# Altium schematic sheet Sensors.SchDoc
size A4; SheetNumber: 4; SheetTotal: 4
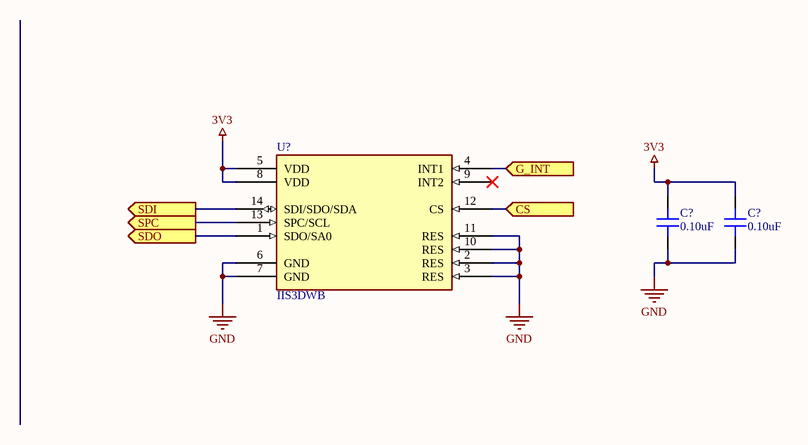
[diagram p0: Sensors.SchDoc]

## Parts
(Parts that share a designator on the sheet are numbered #1, #2 ... from top to bottom, then left to right.)
C?#1  0.10uF  [CAP 0603/1608]
C?#2  0.10uF  [CAP 0603/1608]
U?  IIS3DWB  [PQFN50P250X300X86-14N]

## Ports
CS (in), G_INT (in), SDI (out), SDO (out), SPC (out)

## Nets
3V3: C?#1.2 C?#2.2 U?.5(VDD) U?.8(VDD)
GND: C?#1.1 C?#2.1 U?.2(RES) U?.3(RES) U?.6(GND) U?.7(GND) U?.10(RES) U?.11(RES)
CS: U?.12(CS) ; port CS
G_INT: U?.4(INT1) ; port G_INT
SDI: U?.14(SDI/SDO/SDA) ; port SDI
SDO: U?.1(SDO/SA0) ; port SDO
SPC: U?.13(SPC/SCL) ; port SPC

Not connected (* = marked no-connect by the designer): U? 9(INT2)*

## Library data of the parts
C?#1 C?#2 = CL10B104KA8NNNC: CAP CER 0.1UF 25V X7R 0603; Manufacturer: Samsung Electro-Mechanics America, Inc.; TemperatureRange: -55C ~ 125C; Tolerance: 10%; Value: 0.10uF; Part Number: CL10B104KA8NNNC; PartId: 13014; Supplier 1: Digi-Key; Supplier Part Number 1: 1276-1006-2-ND; ComponentLink1Description: Datasheet; ComponentLink1URL: http://www.samsungsem.com/kr/support/product-search/mlcc/CL10B104KA8NNNC.jsp; ComponentLink2Description: Digi-Key Listing; ComponentLink2URL: https://www.digikey.com/product-detail/en/samsung-electro-mechanics-america-inc/CL10B104KA8NNNC/1276-1006-2-ND/3886664; TemperatureCoefficient: X7R; Voltage: 25V; Price: 0.0035; Device Package: 0603 (1608 Metric)
U? = IIS3DWB: 3-axis digital vibration sensor